# Altium schematic sheet Low_Side_Drivers.SchDoc: Low Side Drivers
size B; SheetNumber: 2; SheetTotal: 5
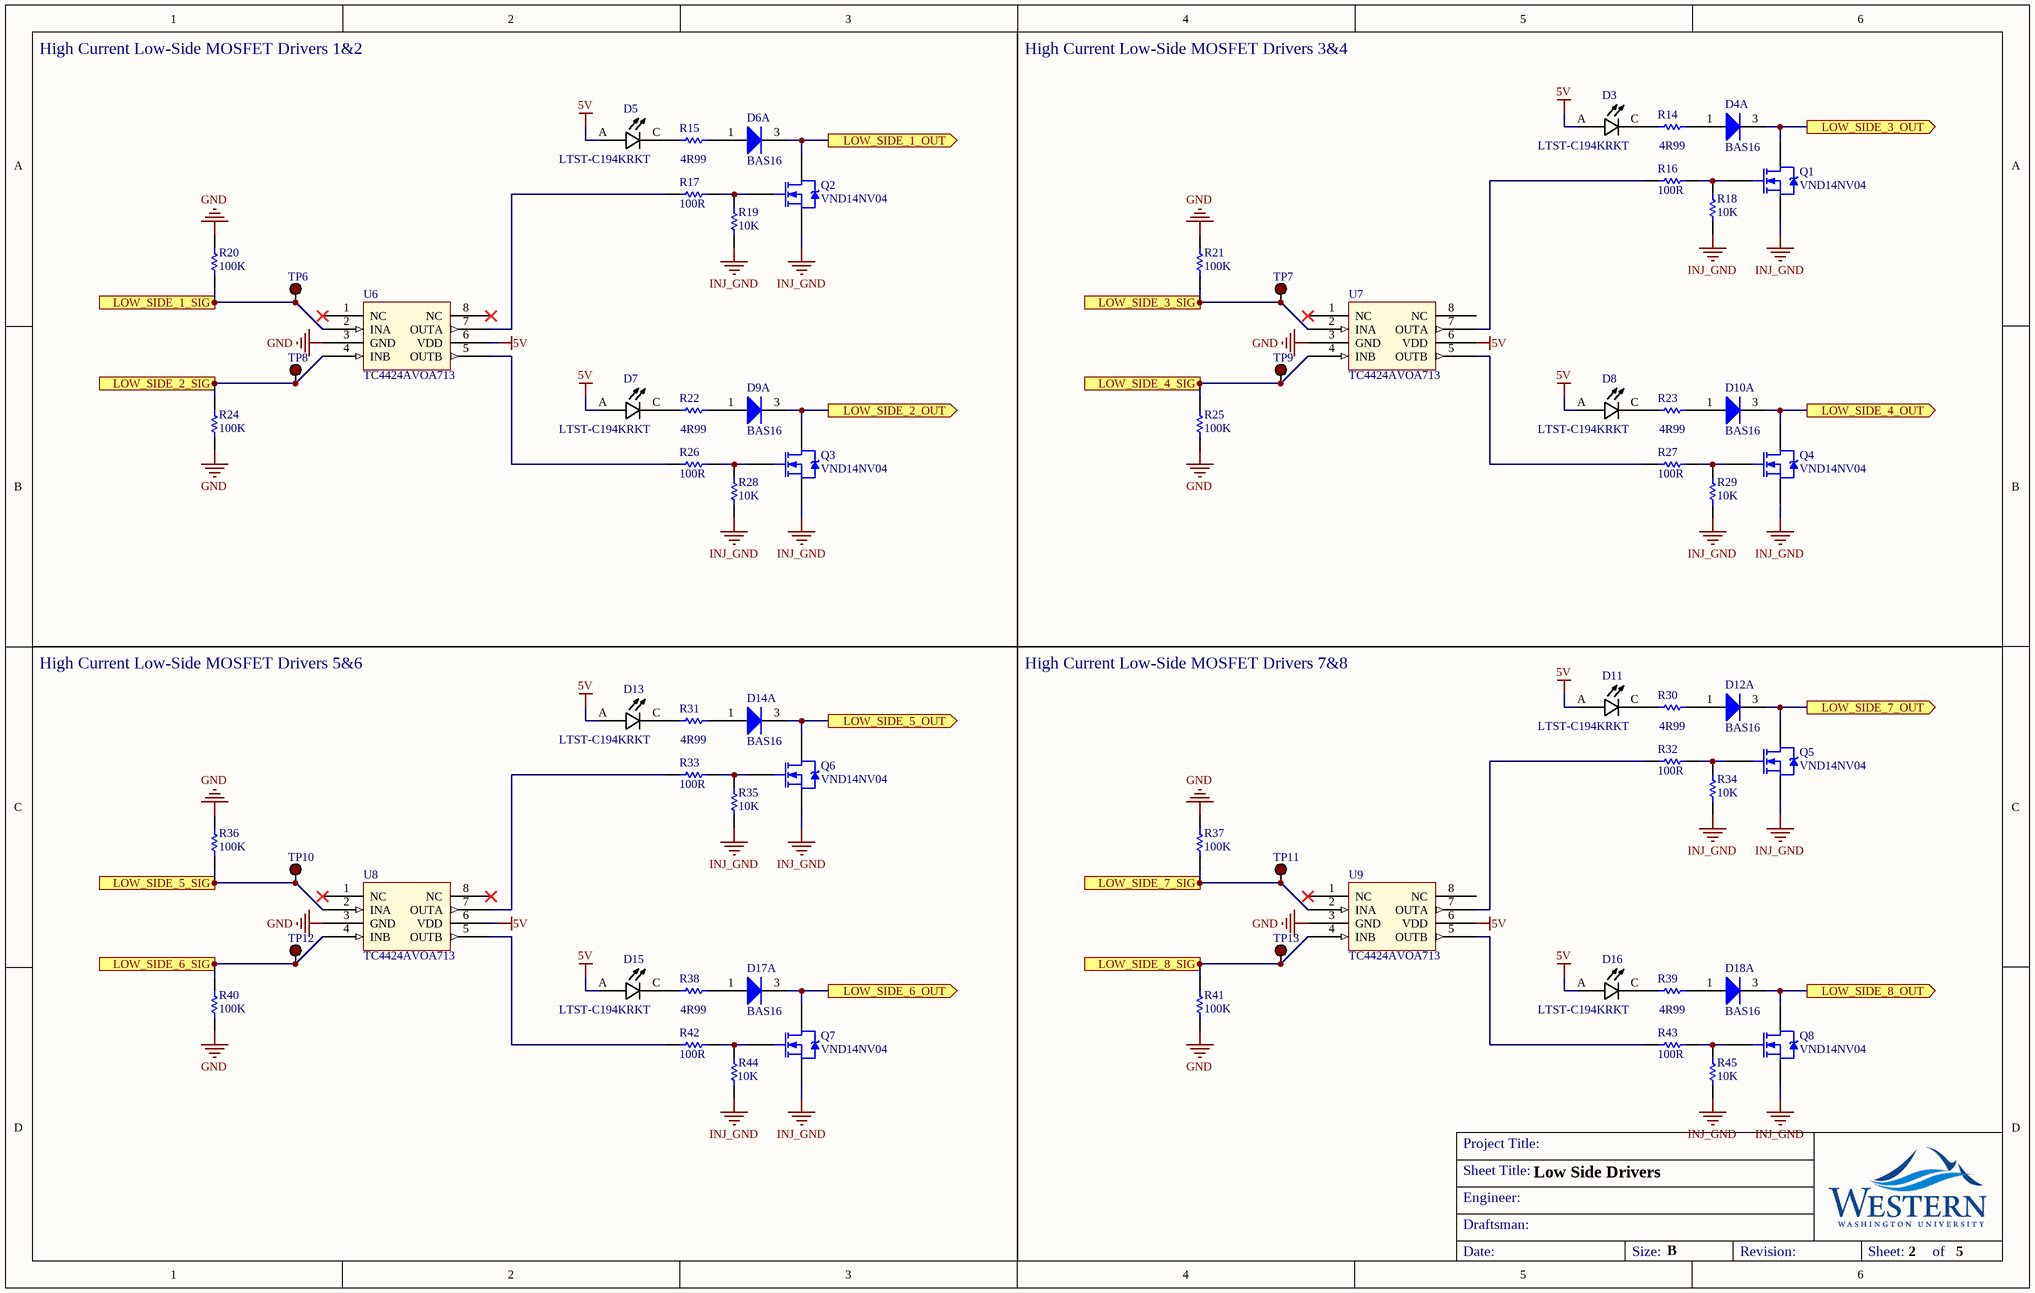
[diagram p0: Low_Side_Drivers.SchDoc]

## Parts
D3  LTST-C194KRKT  [LEDC1608X35N_LTST-C194KRKT]
D4  BAS16  [NXP-SOT23-3_V]  (part A of 2)
D5  LTST-C194KRKT  [LEDC1608X35N_LTST-C194KRKT]
D6  BAS16  [NXP-SOT23-3_V]  (part A of 2)
D7  LTST-C194KRKT  [LEDC1608X35N_LTST-C194KRKT]
D8  LTST-C194KRKT  [LEDC1608X35N_LTST-C194KRKT]
D9  BAS16  [NXP-SOT23-3_V]  (part A of 2)
D10  BAS16  [NXP-SOT23-3_V]  (part A of 2)
D11  LTST-C194KRKT  [LEDC1608X35N_LTST-C194KRKT]
D12  BAS16  [NXP-SOT23-3_V]  (part A of 2)
D13  LTST-C194KRKT  [LEDC1608X35N_LTST-C194KRKT]
D14  BAS16  [NXP-SOT23-3_V]  (part A of 2)
D15  LTST-C194KRKT  [LEDC1608X35N_LTST-C194KRKT]
D16  LTST-C194KRKT  [LEDC1608X35N_LTST-C194KRKT]
D17  BAS16  [NXP-SOT23-3_V]  (part A of 2)
D18  BAS16  [NXP-SOT23-3_V]  (part A of 2)
Q1  VND14NV04  [VND14NV04]
Q2  VND14NV04  [VND14NV04]
Q3  VND14NV04  [VND14NV04]
Q4  VND14NV04  [VND14NV04]
Q5  VND14NV04  [VND14NV04]
Q6  VND14NV04  [VND14NV04]
Q7  VND14NV04  [VND14NV04]
Q8  VND14NV04  [VND14NV04]
R14  4R99  [RESC0603(1608)_M]
R15  4R99  [RESC0603(1608)_M]
R16  100R  [RESC1206(3216)_L]
R17  100R  [RESC1206(3216)_L]
R18  10K  [RESC0603(1608)_M]
R19  10K  [RESC0603(1608)_M]
R20  100K  [RESC0603(1608)_M]
R21  100K  [RESC0603(1608)_M]
R22  4R99  [RESC0603(1608)_M]
R23  4R99  [RESC0603(1608)_M]
R24  100K  [RESC0603(1608)_M]
R25  100K  [RESC0603(1608)_M]
R26  100R  [RESC1206(3216)_L]
R27  100R  [RESC1206(3216)_L]
R28  10K  [RESC0603(1608)_M]
R29  10K  [RESC0603(1608)_M]
R30  4R99  [RESC0603(1608)_M]
R31  4R99  [RESC0603(1608)_M]
R32  100R  [RESC1206(3216)_L]
R33  100R  [RESC1206(3216)_L]
R34  10K  [RESC0603(1608)_M]
R35  10K  [RESC0603(1608)_M]
R36  100K  [RESC0603(1608)_M]
R37  100K  [RESC0603(1608)_M]
R38  4R99  [RESC0603(1608)_M]
R39  4R99  [RESC0603(1608)_M]
R40  100K  [RESC0603(1608)_M]
R41  100K  [RESC0603(1608)_M]
R42  100R  [RESC1206(3216)_L]
R43  100R  [RESC1206(3216)_L]
R44  10K  [RESC0603(1608)_M]
R45  10K  [RESC0603(1608)_M]
TP6  5001  [Keystone_5001]  (value not drawn)
TP7  5001  [Keystone_5001]  (value not drawn)
TP8  5001  [Keystone_5001]  (value not drawn)
TP9  5001  [Keystone_5001]  (value not drawn)
TP10  5001  [Keystone_5001]  (value not drawn)
TP11  5001  [Keystone_5001]  (value not drawn)
TP12  5001  [Keystone_5001]  (value not drawn)
TP13  5001  [Keystone_5001]  (value not drawn)
U6  TC4424AVOA713  [TC4424AVOA713]
U7  TC4424AVOA713  [TC4424AVOA713]
U8  TC4424AVOA713  [TC4424AVOA713]
U9  TC4424AVOA713  [TC4424AVOA713]

## Ports
LOW_SIDE_1_OUT (out), LOW_SIDE_1_SIG (in), LOW_SIDE_2_OUT (out), LOW_SIDE_2_SIG (in), LOW_SIDE_3_OUT (out), LOW_SIDE_3_SIG (in), LOW_SIDE_4_OUT (out), LOW_SIDE_4_SIG (in), LOW_SIDE_5_OUT (out), LOW_SIDE_5_SIG (in), LOW_SIDE_6_OUT (out), LOW_SIDE_6_SIG (in), LOW_SIDE_7_OUT (out), LOW_SIDE_7_SIG (in), LOW_SIDE_8_OUT (out), LOW_SIDE_8_SIG (in)

## Nets
5V: D3.A D5.A D7.A D8.A D11.A D13.A D15.A D16.A U6.6(VDD) U7.6(VDD) U8.6(VDD) U9.6(VDD)
GND: R20.1 R21.1 R24.1 R25.1 R36.1 R37.1 R40.1 R41.1 U6.3(GND) U7.3(GND) U8.3(GND) U9.3(GND)
INJ_GND: Q1.3(S) Q2.3(S) Q3.3(S) Q4.3(S) Q5.3(S) Q6.3(S) Q7.3(S) Q8.3(S) R18.1 R19.1 R28.1 R29.1 R34.1 R35.1 R44.1 R45.1
LOW_SIDE_1_OUT: D6.3(K) Q2.4(D) ; port LOW_SIDE_1_OUT
LOW_SIDE_1_SIG: R20.2 TP6.1(TP) U6.2(INA) ; port LOW_SIDE_1_SIG
LOW_SIDE_2_OUT: D9.3(K) Q3.4(D) ; port LOW_SIDE_2_OUT
LOW_SIDE_2_SIG: R24.2 TP8.1(TP) U6.4(INB) ; port LOW_SIDE_2_SIG
LOW_SIDE_3_OUT: D4.3(K) Q1.4(D) ; port LOW_SIDE_3_OUT
LOW_SIDE_3_SIG: R21.2 TP7.1(TP) U7.2(INA) ; port LOW_SIDE_3_SIG
LOW_SIDE_4_OUT: D10.3(K) Q4.4(D) ; port LOW_SIDE_4_OUT
LOW_SIDE_4_SIG: R25.2 TP9.1(TP) U7.4(INB) ; port LOW_SIDE_4_SIG
LOW_SIDE_5_OUT: D14.3(K) Q6.4(D) ; port LOW_SIDE_5_OUT
LOW_SIDE_5_SIG: R36.2 TP10.1(TP) U8.2(INA) ; port LOW_SIDE_5_SIG
LOW_SIDE_6_OUT: D17.3(K) Q7.4(D) ; port LOW_SIDE_6_OUT
LOW_SIDE_6_SIG: R40.2 TP12.1(TP) U8.4(INB) ; port LOW_SIDE_6_SIG
LOW_SIDE_7_OUT: D12.3(K) Q5.4(D) ; port LOW_SIDE_7_OUT
LOW_SIDE_7_SIG: R37.2 TP11.1(TP) U9.2(INA) ; port LOW_SIDE_7_SIG
LOW_SIDE_8_OUT: D18.3(K) Q8.4(D) ; port LOW_SIDE_8_OUT
LOW_SIDE_8_SIG: R41.2 TP13.1(TP) U9.4(INB) ; port LOW_SIDE_8_SIG
NetD3_C: D3.C R14.1
NetD4_1: D4.1(A) R14.2
NetD5_C: D5.C R15.1
NetD6_1: D6.1(A) R15.2
NetD7_C: D7.C R22.1
NetD8_C: D8.C R23.1
NetD9_1: D9.1(A) R22.2
NetD10_1: D10.1(A) R23.2
NetD11_C: D11.C R30.1
NetD12_1: D12.1(A) R30.2
NetD13_C: D13.C R31.1
NetD14_1: D14.1(A) R31.2
NetD15_C: D15.C R38.1
NetD16_C: D16.C R39.1
NetD17_1: D17.1(A) R38.2
NetD18_1: D18.1(A) R39.2
NetQ1_1: Q1.1(G) R16.2 R18.2
NetQ2_1: Q2.1(G) R17.2 R19.2
NetQ3_1: Q3.1(G) R26.2 R28.2
NetQ4_1: Q4.1(G) R27.2 R29.2
NetQ5_1: Q5.1(G) R32.2 R34.2
NetQ6_1: Q6.1(G) R33.2 R35.2
NetQ7_1: Q7.1(G) R42.2 R44.2
NetQ8_1: Q8.1(G) R43.2 R45.2
NetR16_1: R16.1 U7.7(OUTA)
NetR17_1: R17.1 U6.7(OUTA)
NetR26_1: R26.1 U6.5(OUTB)
NetR27_1: R27.1 U7.5(OUTB)
NetR32_1: R32.1 U9.7(OUTA)
NetR33_1: R33.1 U8.7(OUTA)
NetR42_1: R42.1 U8.5(OUTB)
NetR43_1: R43.1 U9.5(OUTB)

Not connected (* = marked no-connect by the designer): U6 1(NC)* 8(NC)*; U7 1(NC)* 8(NC); U8 1(NC)* 8(NC)*; U9 1(NC)* 8(NC)

## Notes on the sheet
- High Current Low-Side MOSFET Drivers 1&2
- High Current Low-Side MOSFET Drivers 3&4
- High Current Low-Side MOSFET Drivers 5&6
- High Current Low-Side MOSFET Drivers 7&8
- Sheet Title:
- Project Title:
- Engineer:
- Draftsman:
- Date:
- Size:
- B
- Revision:
- Sheet:        of

## Library data of the parts
D3 D5 D7 D8 D11 D13 D15 D16 = LTST-C194KRKT: Red 631nm LED Indication - Discrete 2V 0603 _1608 Metric_; MF: Lite-On Inc.; Digi-Key_Purchase_URL: https://www.digikey.com/product-detail/en/lite-on-inc/LTST-C194KRKT/160-1835-1-ND/2356232?utm_source=snapeda&utm_medium=aggregator&utm_campaign=symbol; MP: LTST-C194KRKT; Package: 0603 Lite-On; SnapEDA_Link: https://www.snapeda.com/parts/LTST-C194KRKT/Lite-On%20Inc./view-part/370565/?ref=snap; Digi-Key_Part_Number: 160-1835-1-ND; Value: *
D4 D6 D9 D10 D12 D14 D17 D18 = CMP-0648-00001-1: High-speed Switching Diode, 100 V, 4 ns, -65 to 150 degC, 3-Pin SOT23, RoHS, Tape and Reel; Manufacturer: NXP Semiconductors; Ptot (mW): 250; VFR (V): 1.75; VRRM (V): 100; Cd (pF): 1.5; Rth (j-t) (K/W): 330; trr (ns): 4; Rth (j-a) (K/W): 500; IF (mA): 215; ComponentLink1Description: Manufacturer URL; DatasheetVersion: Rev. 05; ComponentLink2Description: Datasheet; Temperature Range: -65 to 150 degC; RoHS: TRUE; PackageDescription: 3-Pin Plastic Surface-mounted Package, Body 1.3 x 2.9 mm, Pitch 0.95 mm; Packing: Tape and Reel; PartNumber: BAS16; ComponentLink1URL: http://www.nxp.com/; VR (V): 100; Mounting Technology: Surface Mount; ComponentLink2URL: http://www.nxp.com/documents/data_sheet/BAS16_SER.pdf; PackageReference: SOT23-3; IFRM (mA): 500
R14 R15 R22 R23 R30 R31 R38 R39 = CMP-1012-00250-1: 4R99 0.1W 1% 0603 (1608 Metric)  SMD; Value: 4.99 Ohm; Case-Metric: 1608; Case-EIA: 0603; Technology: SMT; Tolerance: 1 %; Power: 0.1 W
R16 R17 R26 R27 R32 R33 R42 R43 = CMP-1014-00397-1: 100R 0.25W 1% 1206 (3216 Metric)  SMD; Value: 100.00 Ohm; Case-Metric: 3216; Case-EIA: 1206; Technology: SMT; Tolerance: 1 %; Power: 0.25 W
R18 R19 R28 R29 R34 R35 R44 R45 = CMP-1012-00623-1: 10K 0.1W 1% 0603 (1608 Metric)  SMD; Value: 10000.00 Ohm; Case-EIA: 0603; Case-Metric: 1608; Power: 0.1 W; Tolerance: 1 %; Technology: SMT
R20 R21 R24 R25 R36 R37 R40 R41 = CMP-1012-00736-1: 100K 0.1W 1% 0603 (1608 Metric)  SMD; Value: 100000.00 Ohm; Case-Metric: 1608; Case-EIA: 0603; Power: 0.1 W; Tolerance: 1 %; Technology: SMT
TP6-TP13 = TEST POINT: TEST POINT PC MINI .040"D BLACK; Manufacturer: Keystone Electronics; Supplier 1: Digi-Key; Manufacturer Part Number: 5001; RoHS: RoHS Compliant; Category: Test and Measurement; Stock 1: 7538; Pricing 1: 1=0.34, 10=0.315, 50=0.2296, 100=0.2206, 250=0.19812, 500=0.1891, 1000=0.15759, 2500=0.14408, 5000=0.13508 (USD); Packaging: Bulk; Type: PC Test Point, Miniature; Terminal: 0.010" x 0.020" (0.25mm x 0.51mm) Phosphor Bronze Wire, Silver Plated; Mounting Type: 0.040" (1.02mm) Hole Diameter; Material: Base, Nylon 46, UL 94V-0; Color: Black; ComponentLink1URL: http://www.keyelco.com/product-pdf.cfm?p=1310; ComponentLink1Description: http://www.keyelco.com/product-pdf.cfm?p=1310; Supplier Part Number 1: 5001K-ND